# Altium schematic sheet Master_1.SchDoc
size A4
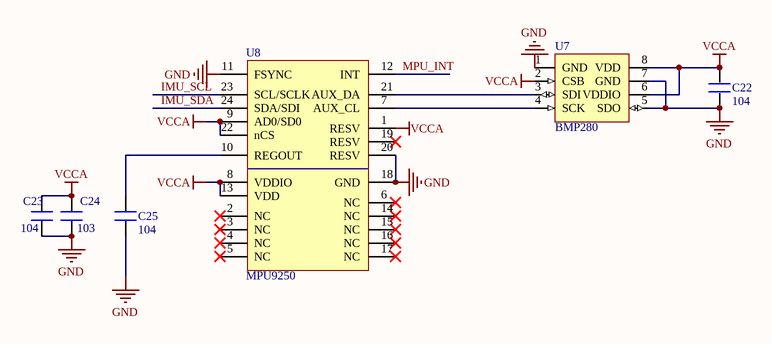
[diagram p0: Master_1.SchDoc]

## Parts
C22  104  [0402]
C23  104  [0402]
C24  103  [0402]
C25  104  [0402]
U7  BMP280  [LGA-8]
U8  MPU9250  [QFN24-0.4]

## Nets
GND: C22.1 C23.1 C24.1 C25.1 U7.1(GND) U7.5(SDO) U7.7(GND) U8.11(FSYNC) U8.18(GND) U8.20(RESV)
VCCA: C22.2 C23.2 C24.2 U7.2(CSB) U7.6(VDDIO) U7.8(VDD) U8.1(RESV) U8.8(VDDIO) U8.9(AD0/SD0) U8.13(VDD) U8.22(nCS)
IMU_SCL: U8.23(SCL/SCLK)
IMU_SDA: U8.24(SDA/SDI)
MPU_INT: U8.12(INT)
NetC25_2: C25.2 U8.10(REGOUT)
NetU7_3: U7.3(SDI) U8.21(AUX_DA)
NetU7_4: U7.4(SCK) U8.7(AUX_CL)

Not connected (* = marked no-connect by the designer): U8 2(NC)* 3(NC)* 4(NC)* 5(NC)* 6(NC)* 14(NC)* 15(NC)* 16(NC)* 17(NC)* 19(RESV)*

## Library data of the parts
C22-C25 = C